# Altium project PCB_Project_1.PrjPcb
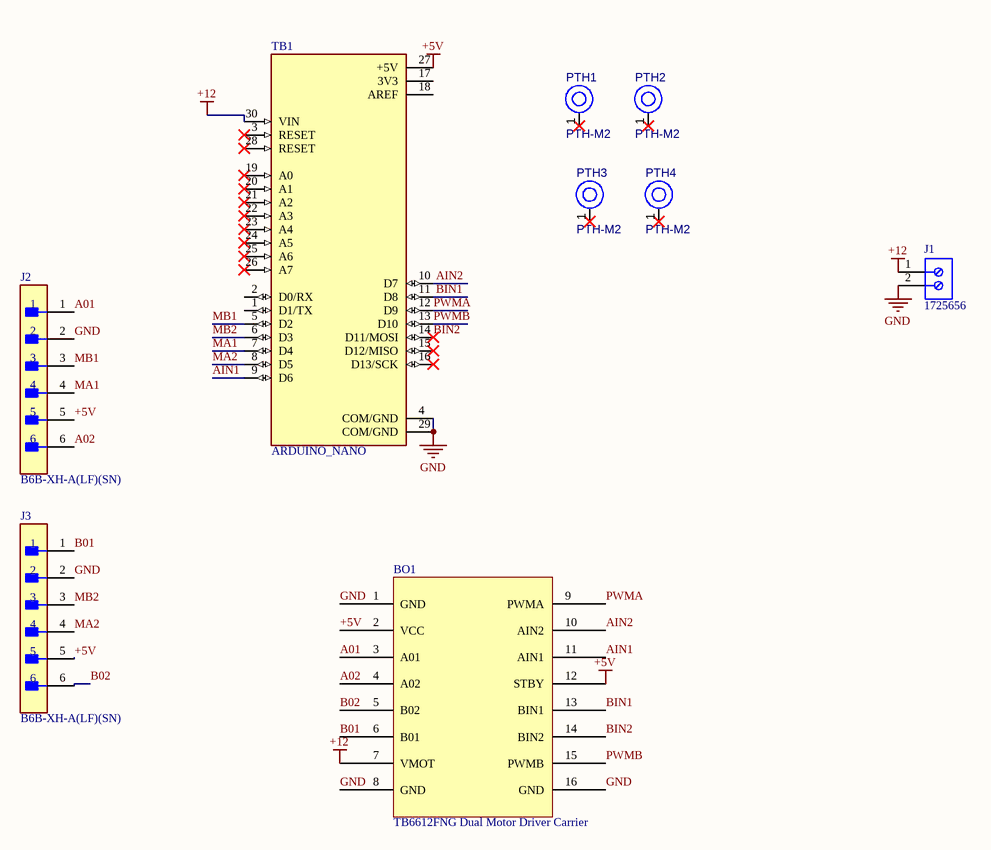
[diagram p0: Schemeatic_1_0.SchDoc]
1 sheet, 9 parts. Net scope: global (net labels, ports and power ports of the same name join across sheets).
Board file: PCB1.PcbDoc

## Sheet Schemeatic_1_0.SchDoc
size A4; SheetNumber: 1; SheetTotal: 1

### Parts
BO1  TB6612FNG Dual Motor Driver Carrier  [DIP16 - duplicate1]
J1  1725656  [PHOE-1725656-2]
J2  B6B-XH-A(LF)(SN)  [FP-B6B-XH-A_LF_SN-MFG]
J3  B6B-XH-A(LF)(SN)  [FP-B6B-XH-A_LF_SN-MFG]
PTH1  PTH-M2  [PTH-M2]
PTH2  PTH-M2  [PTH-M2]
PTH3  PTH-M2  [PTH-M2]
PTH4  PTH-M2  [PTH-M2]
TB1  ARDUINO_NANO  [SHIELD_ARDUINO_NANO]

### Nets
+5V: BO1.2(VCC) BO1.12(STBY) J2.5 J3.5 TB1.27(+5V)
+12: BO1.7(VMOT) J1.1 TB1.30(VIN)
GND: BO1.1(GND) BO1.8(GND) BO1.16(GND) J1.2 J2.2 J3.2 TB1.4(COM/GND) TB1.29(COM/GND)
A01: BO1.3(A01) J2.1
A02: BO1.4(A02) J2.6
AIN1: BO1.11(AIN1) TB1.9(D6)
AIN2: BO1.10(AIN2) TB1.10(D7)
B01: BO1.6(B01) J3.1
B02: BO1.5(B02) J3.6
BIN1: BO1.13(BIN1) TB1.11(D8)
BIN2: BO1.14(BIN2) TB1.14(D11/MOSI)
MA1: J2.4 TB1.7(D4)
MA2: J3.4 TB1.8(D5)
MB1: J2.3 TB1.5(D2)
MB2: J3.3 TB1.6(D3)
PWMA: BO1.9(PWMA) TB1.12(D9)
PWMB: BO1.15(PWMB) TB1.13(D10)

Not connected (* = marked no-connect by the designer): PTH1 1(H1)*; PTH2 1(H1)*; PTH3 1(H1)*; PTH4 1(H1)*; TB1 1(D1/TX) 2(D0/RX) 3(RESET)* 15(D12/MISO)* 16(D13/SCK)* 17(3V3) 18(AREF) 19(A0)* 20(A1)* 21(A2)* 22(A3)* 23(A4)* 24(A5)* 25(A6)* 26(A7)* 28(RESET)*

### Library data of the parts
BO1 = TB6612FNG_Breakout
J1 = CMP-2000-05299-1: Male Header, Pitch 2.54 mm, 1 x 2 Position, Height 9 mm, Tail Length 3.5 mm; Manufacturer: Phoenix Contact; Number of contacts: 2; Content: 250pc(s); Pitch: 2.54mm; Industrial packaging: Yes; Colour: Green; Manufacturer part No.: 1725656; Type: MPT0,5/2-2,54; Datasheet URL: http://datasheet.octopart.com/1725656-Phoenix-Contact-datasheet-5302866.pdf; Manufacturer URL: http://www.phoenixcontact.com/; Datasheet Version: Apr-08
J2 J3 = CMP-17439-000076-1: CONN HEADER VERT 6POS 2.5MM
PTH1-PTH4 = CMP-00028-00016-2: M2 Clearance (2.2 mm) Plated Through Hole, 6mm Diameter Pad; Created By: Robert Howie; Source: Components - 02.08.23 - 11.22.SchLib; Pins: 1; Design Item ID: CMP-00003-1
TB1 = ARDUINO_NANO: Small, complete, and breadboard-friendly board based on the ATmega328 (Arduino Nano 3.x); Check_prices: https://www.snapeda.com/parts/Arduino%20Nano/Arduino/view-part/?ref=eda; Value: *; Availability: Not in stock; MP: Arduino Nano; Price: None; Package: Non-Standard Arduino; SnapEDA_Link: https://www.snapeda.com/parts/Arduino%20Nano/Arduino/view-part/?ref=snap; MF: Arduino